# Altium schematic sheet ZH.SchDoc
size Tabloid
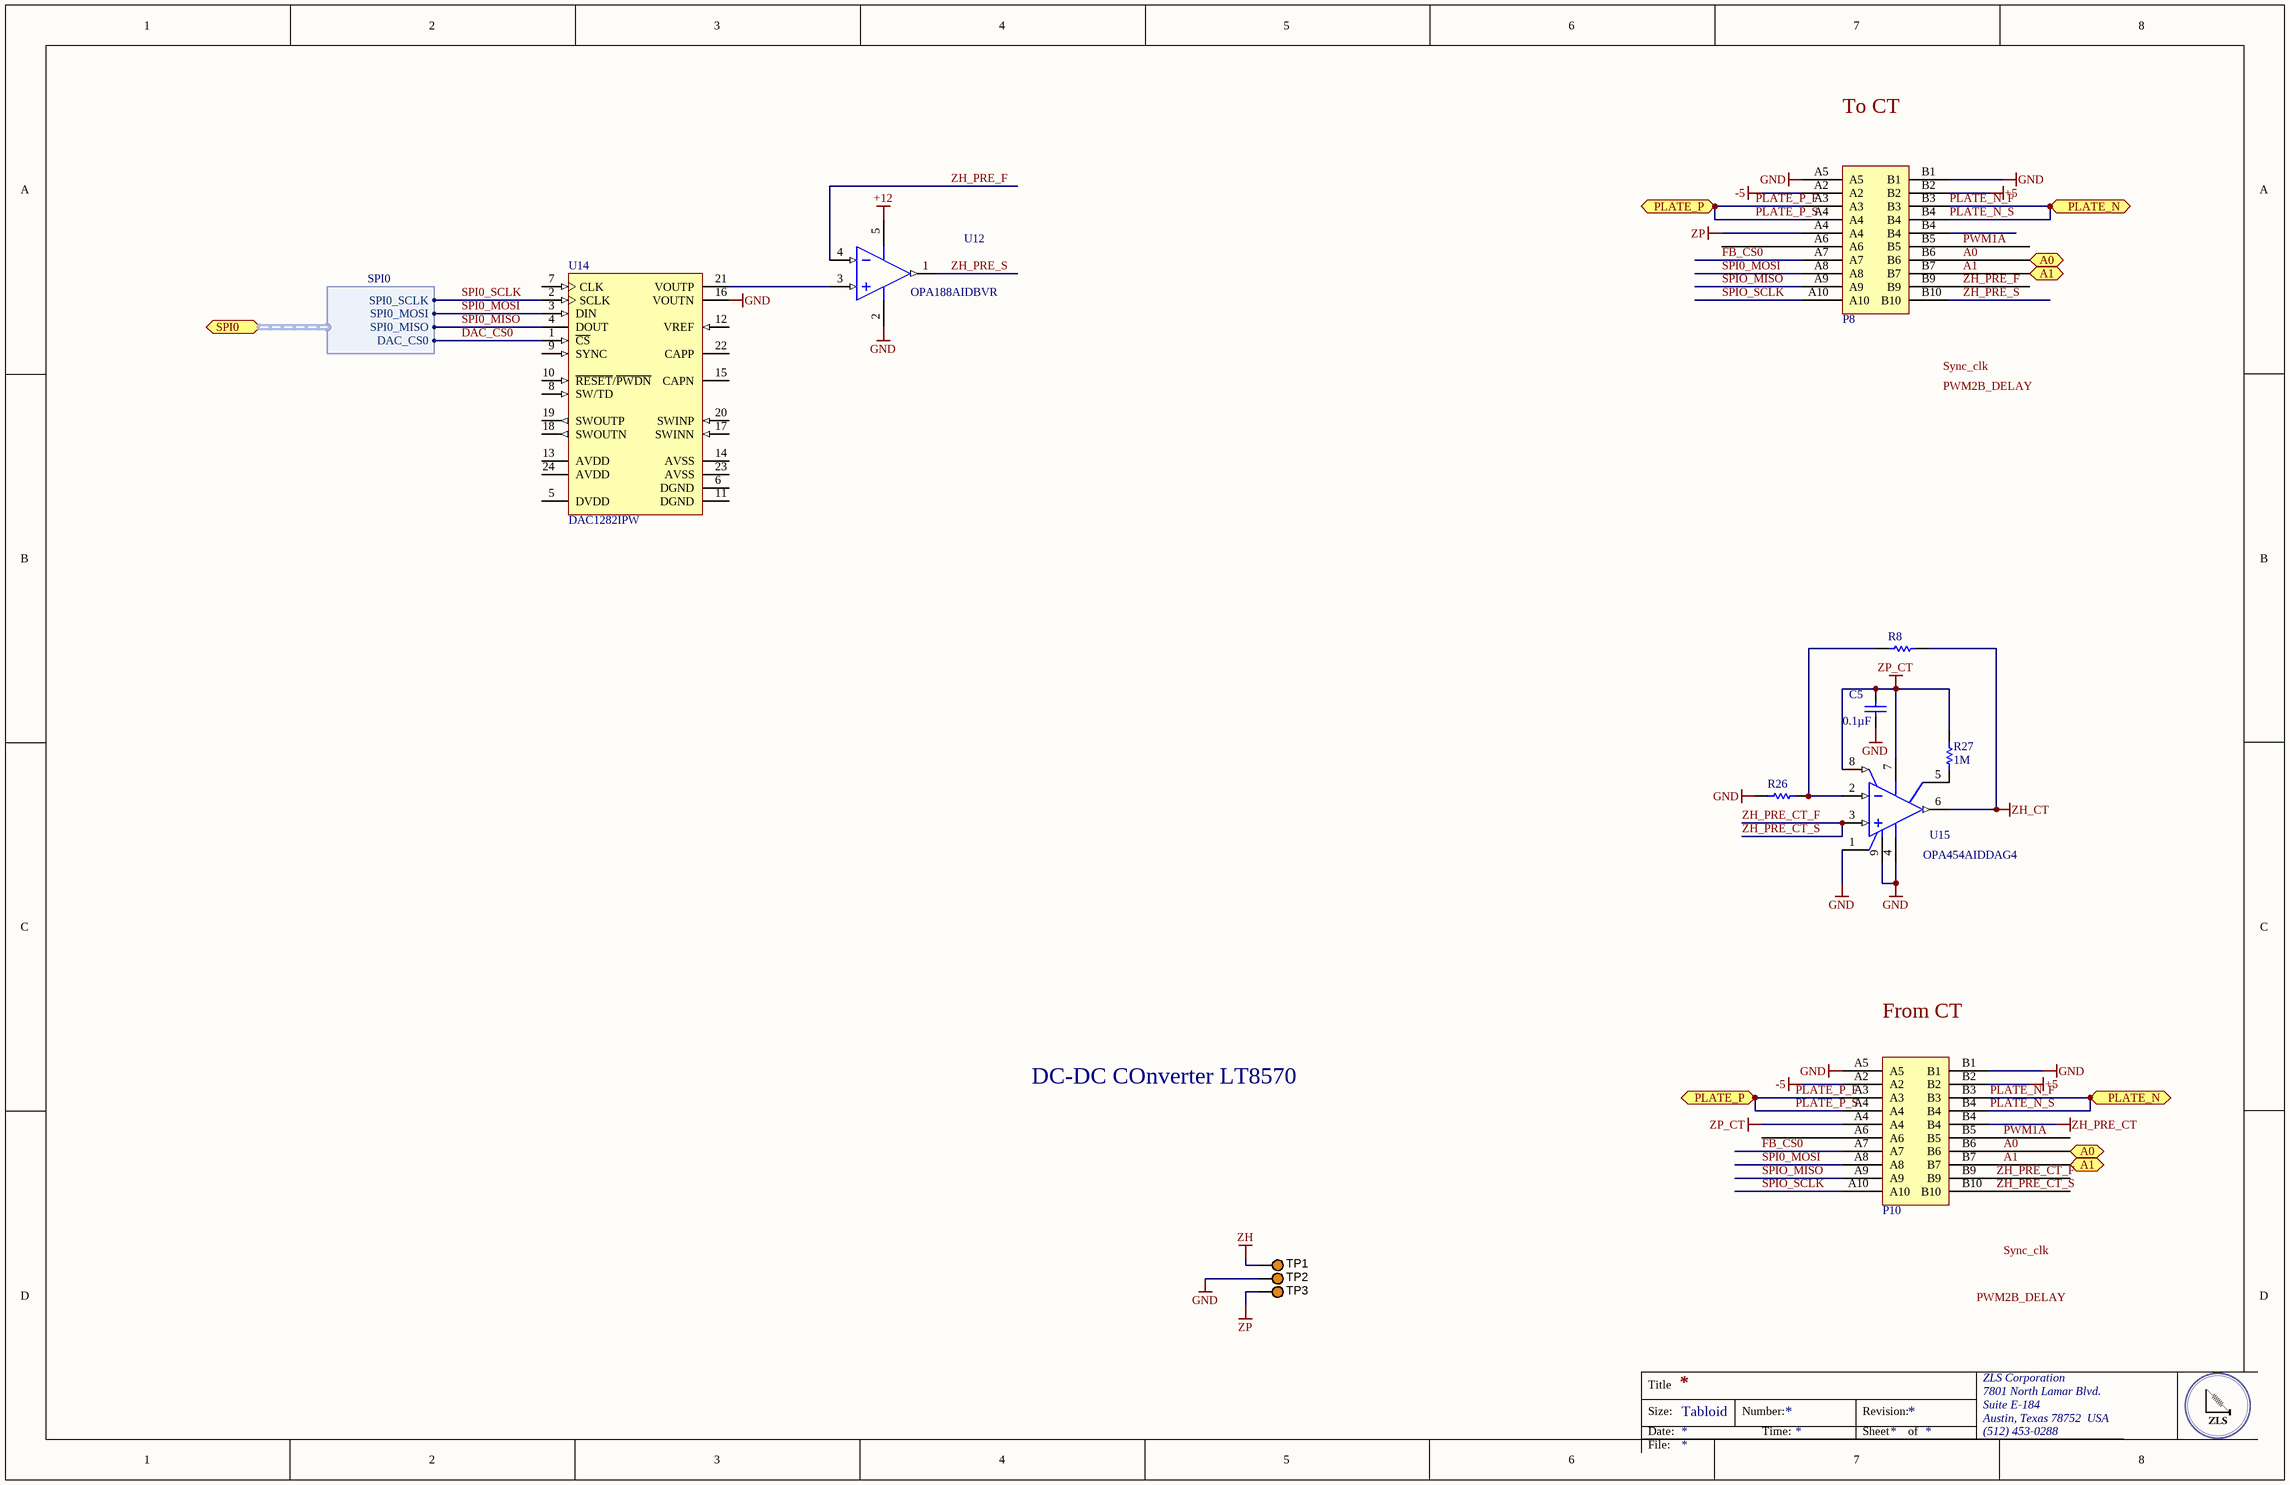
[diagram p0: ZH.SchDoc]

## Parts
C5  Capacitance: 0.1µF  [CAPC0805(2012)145_N]  (hidden comment: CAP CER 0.1UF 25V X7R 0805)
P8  MEC6-110-0-PCB  [MEC6-110-02-L-DV]  (value not drawn)
P10  MEC6-110-0-PCB  [MEC6-110-02-L-DV]  (value not drawn)
R8  (no value)  [RESC0402(1005)_M]
R26  (no value)  [RESC0402(1005)_M]
R27  1M  [RESC0402(1005)_M]
TP1  5003  [KSTN-5003]  (value not drawn)
TP2  5003  [KSTN-5003]  (value not drawn)
TP3  5003  [KSTN-5003]  (value not drawn)
U12  OPA188AIDBVR  [DBV0005A_M]
U14  DAC1282IPW  [TI-PW24_M]
U15  OPA454AIDDAG4  [TI-DDA8-2745X2245TP_N]

## Ports
A0, A1, PLATE_N, PLATE_P, SPI0 (harness SPI0)

## Harnesses
SPI0: DAC_CS0, SPI0_MOSI, SPI0_MISO, SPI0_SCLK

## Nets
+5: P8.B2 P10.B2
+12: U12.5(V+)
-5: P8.A2 P10.A2
GND: C5.2 P8.A5 P8.B1 P10.A5 P10.B1 R26.2 TP2.1 U12.2(V-) U14.16(VOUTN) U15.1(E/D_COM) U15.4(V-) U15.9(EP)
ZH: TP1.1
ZH_CT: R8.1 U15.6(OUT)
ZH_PRE_CT: P10.B4
ZP: P8.A4 TP3.1
ZP_CT: C5.1 P10.A4 R27.2 U15.7(V+) U15.8(E/D)
A0: P8.B6 P10.B6 ; port A0
A1: P8.B7 P10.B7 ; port A1
DAC_CS0: U14.1(~{CS}) ; port SPI0.DAC_CS0
FB_CS0: P8.A7 P10.A7
PLATE_N_F: P8.B3 P8.B4 P10.B3 P10.B4 ; port PLATE_N  [also labelled PLATE_N_S]
PLATE_P_F: P8.A3 P8.A4 P10.A3 P10.A4 ; port PLATE_P  [also labelled PLATE_P_S]
PWM1A: P8.B5 P10.B5
SPI0_MISO: U14.4(DOUT) ; port SPI0.SPI0_MISO
SPI0_MOSI: P8.A8 P10.A8 U14.3(DIN) ; port SPI0.SPI0_MOSI
SPI0_SCLK: U14.2(SCLK) ; port SPI0.SPI0_SCLK
SPIO_MISO: P8.A9 P10.A9
SPIO_SCLK: P8.A10 P10.A10
ZH_PRE_CT_F: P10.B9 P10.B10 U15.3(IN+)  [also labelled ZH_PRE_CT_S]
ZH_PRE_F: P8.B9 U12.4(IN-)
ZH_PRE_S: P8.B10 U12.1(OUT)
NetR8_2: R8.2 R26.1 U15.2(IN-)
NetR27_1: R27.1 U15.5(STATUS_FLAG)
NetU12_3: U12.3(IN+) U14.21(VOUTP)

Not connected (* = marked no-connect by the designer): P8 A6; P10 A6; U14 5(DVDD) 6(DGND) 7(CLK) 8(SW/TD) 9(SYNC) 10(~{RESET}/~{PWDN}) 11(DGND) 12(VREF) 13(AVDD) 14(AVSS) 15(CAPN) 17(SWINN) 18(SWOUTN) 19(SWOUTP) 20(SWINP) 22(CAPP) 23(AVSS) 24(AVDD)

## Notes on the sheet
- To CT
- (near P10) From CT
- DC-DC COnverter LT8570
- Labels drawn without touching a wire or pin: PWM2B_DELAY, Sync_clk
- Title
- Size:
- Date:
- Tabloid
- Number:
- Time:
- Revision:
- Sheet
- of
- ZLS Corporation
- 7801 North Lamar Blvd.
- Suite E-184
- Austin, Texas 78752  USA
- (512) 453-0288
- File:

## Library data of the parts
C5 = CMP-1036-04795-1: Manufacturer: Murata Electronics North America; Manufacturer Part Number: GRM21BR71E104KA01L; Tolerance: ±10%; Supplier 1: Digi-Key; Supplier Part Number 1: 490-1673-6-ND; RoHS: RoHS Compliant; Category: Capacitors; Stock 1: 891652; Pricing 1: 1=0.2, 10=0.145, 100=0.0683, 500=0.04788, 1000=0.03964 (USD); Packaging: Digi-Reel®; Part Status: Active; Voltage - Rated: 25V; Temperature Coefficient: X7R; Operating Temperature: -55°C ~ 125°C; Features: -; Ratings: -; Applications: General Purpose; Mounting Type: Surface Mount, MLCC; Package / Case: 0805 (2012 Metric); Size / Dimension: 0.079" L x 0.049" W (2.00mm x 1.25mm); Height - Seated (Max): -; Thickness (Max): 0.053" (1.35mm); Lead Spacing: -; Lead Style: -; ComponentLink1URL: http://www.murata.com/~/media/webrenewal/support/library/catalog/products/capacitor/mlcc/c02e.ashx; ComponentLink1Description: http://www.murata.com/~/media/webrenewal/support/library/catalog/products/capacitor/mlcc/c02e.ashx
R8 R26 R27 = CMP-1011-00463-1
TP1-TP3 = CMP-1672-00009-1: Test Point, Orange, 1-Pin THD, RoHS; Peak Reverse Current: 600 uA; Forward Current: 3 A; Max Surge Current: 80 A; Forward Voltage: 1.08 V; Max Operating Temperature: 150 degC; PackageReference: 5003; Pins: 2; ComponentLink2URL: http://keyelco.com/userAssets/file/M65p56.pdf; PackageDescription: 1-Pin Through Hole Device, Dia 2.54 mm; Weight: 0.01 lb; Diameter: 5.3 mm; Mount: Through Hole; Package Quantity: 500; Packaging: Bulk; Min Operating Temperature: -65 degC; ComponentLink1Description: Manufacturer URL; Height: 0.25 inch; ComponentLink1URL: http://www.keyelco.com/; ComponentLink2Description: Datasheet; Width: 0.25 inch; REACH SVHC: No SVHC; RoHSCompliant: true; Radiation Hardening: No; Length: 9.5 mm; DatasheetVersion: Jun-15
U12 = CMP-0809-00005-2: Precision, Low Noise, Rail-to-Rail Output, Zero-Drift Operational Amplifier, 4 to 36 V, -40 to 125 degC, 5-pin SOT23 (DBV5), Green (RoHS & no Sb/Br); Manufacturer: Texas Instruments; Total Supply Voltage(Min)(+5V is 5, +/-5V is 10): 4; Offset Drift(Typ)(uV/C): 0.03; Rating: Catalog; SubFamily: Zero Drift Precision Amplifier; GBW(Typ)(MHz): 2; Slew Rate(Typ)(V/us): 0.8; Number of Channels: 1; CMRR(Min)(dB): 120; Iq per channel(Max)(mA): 0.51; Total Supply Voltage(Max)(+5V is 5, +/-5V is 10): 36; PartNumber: OPA188AIDBVR; ComponentLink2Description: Datasheet; ComponentLink2URL: http://www.ti.com/lit/ds/symlink/opa188.pdf; ComponentLink1Description: Manufacturer URL; Mounting Technology: Surface Mount; Eco-Plan: Green (RoHS & no Sb/Br); ComponentLink1URL: http://www.ti.com/; PackageVersion: 4073253-4/K, 03/2006; DatasheetVersion: SBOS642A; ComponentLink3Description: Package Specification; PackageReference: DBV0005A; ComponentLink3URL: http://www.ti.com/litv/pdf/mpds018i; PackageDescription: 5-Pin Plastic Small Outline, Body 1.6 x 2.9 mm, Pitch 0.95 mm; Code_JEDEC: MO-178
U14 = CMP-0004-01365-1: Low Distortion DAC for Seismic Application, -40 to 85 degC, 24-pin SOP (PW24), Green (RoHS & no Sb/Br); Manufacturer: Texas Instruments; Settling Time(us): 25; SubFamily: Precision DAC (=<10MSPS); DAC Channels: 1; Interface: Serial SPI; Power Consumption(Typ)(mW): 38; SNR(dB): 120; Code_JEDEC: MO-153; PackageDescription: 24-Pin Plastic Small Outline, Body 7.8 x 4.4 mm, Pitch 0.65 mm; ComponentLink3URL: http://www.ti.com/litv/pdf/mpds363; ComponentLink2Description: Datasheet; PackageVersion: 4040064-6/G, 02/2011; PartNumber: DAC1282IPW; PackageReference: PW24; ComponentLink2URL: http://www.ti.com/general/docs/lit/getliterature.tsp?genericPartNumber=DAC1282&fileType=pdf; ComponentLink3Description: Package Specification; DatasheetVersion: SBAS490A; Mounting Technology: Surface Mount; ComponentLink1Description: Manufacturer URL; Eco-Plan: Green (RoHS & no Sb/Br); ComponentLink1URL: http://www.ti.com/
U15 = CMP-0017-00715-1: High Voltage (100V), High-Current (50mA) Operational Amplifier, G=1 Stable, 10 to 100 V, -55 to 125 degC, 8-pin SOP (DDA8), Green (RoHS & no Sb/Br); Manufacturer: Texas Instruments; Sub Family: General Purpose Amplifier, High Output Current Amplifier (>=50mA), High Supply Voltage Amplifier (>=30V), Precision Amplifier; Offset Drift(Typ)(uV/C): 1.6; Slew Rate(Typ)(V/us): 13; Number of Channels: 1; Total Supply Voltage(Max)(+5V is 5, +/-5V is 10): 100; Total Supply Voltage(Min)(+5V is 5, +/-5V is 10): 10; Vio (25C)(Max)(mV): 4; GBW(Typ)(MHz): 2.5; Vn at 1kHz(Typ)(nV/rtHz): 47; Rating: Catalog; ComponentLink1URL: http://www.ti.com/; PartNumber: OPA454AIDDAG4; ComponentLink1Description: Manufacturer URL; Eco-Plan: Green (RoHS & no Sb/Br); ComponentLink3URL: http://www.ti.com/litv/pdf/mpds092e; IIB(Max)(pA): 100; ComponentLink2URL: http://www.ti.com/lit/ds/symlink/opa454.pdf; ComponentLink3Description: Package Specification; DatasheetVersion: SBOS391A; Iq per channel(Max)(mA): 4; PackageVersion: 4202561/F, 12/2011; Code_JEDEC: MS-012; CMRR(Min)(dB): 100; PackageReference: DDA8-2745X2245TP; Mounting Technology: Surface Mount; ComponentLink2Description: Datasheet; PackageDescription: 8-Pin PowerPAD(TM) Plastic Small Outline, Body 3.9 x 4.9 mm, Pitch 1.27 mm